# EAGLE design nrf51822 (EAGLE 7.2.0)
CNAME: BLEoT; CREVISION: 1.1; DESIGNER: Mohammed Aljarrah
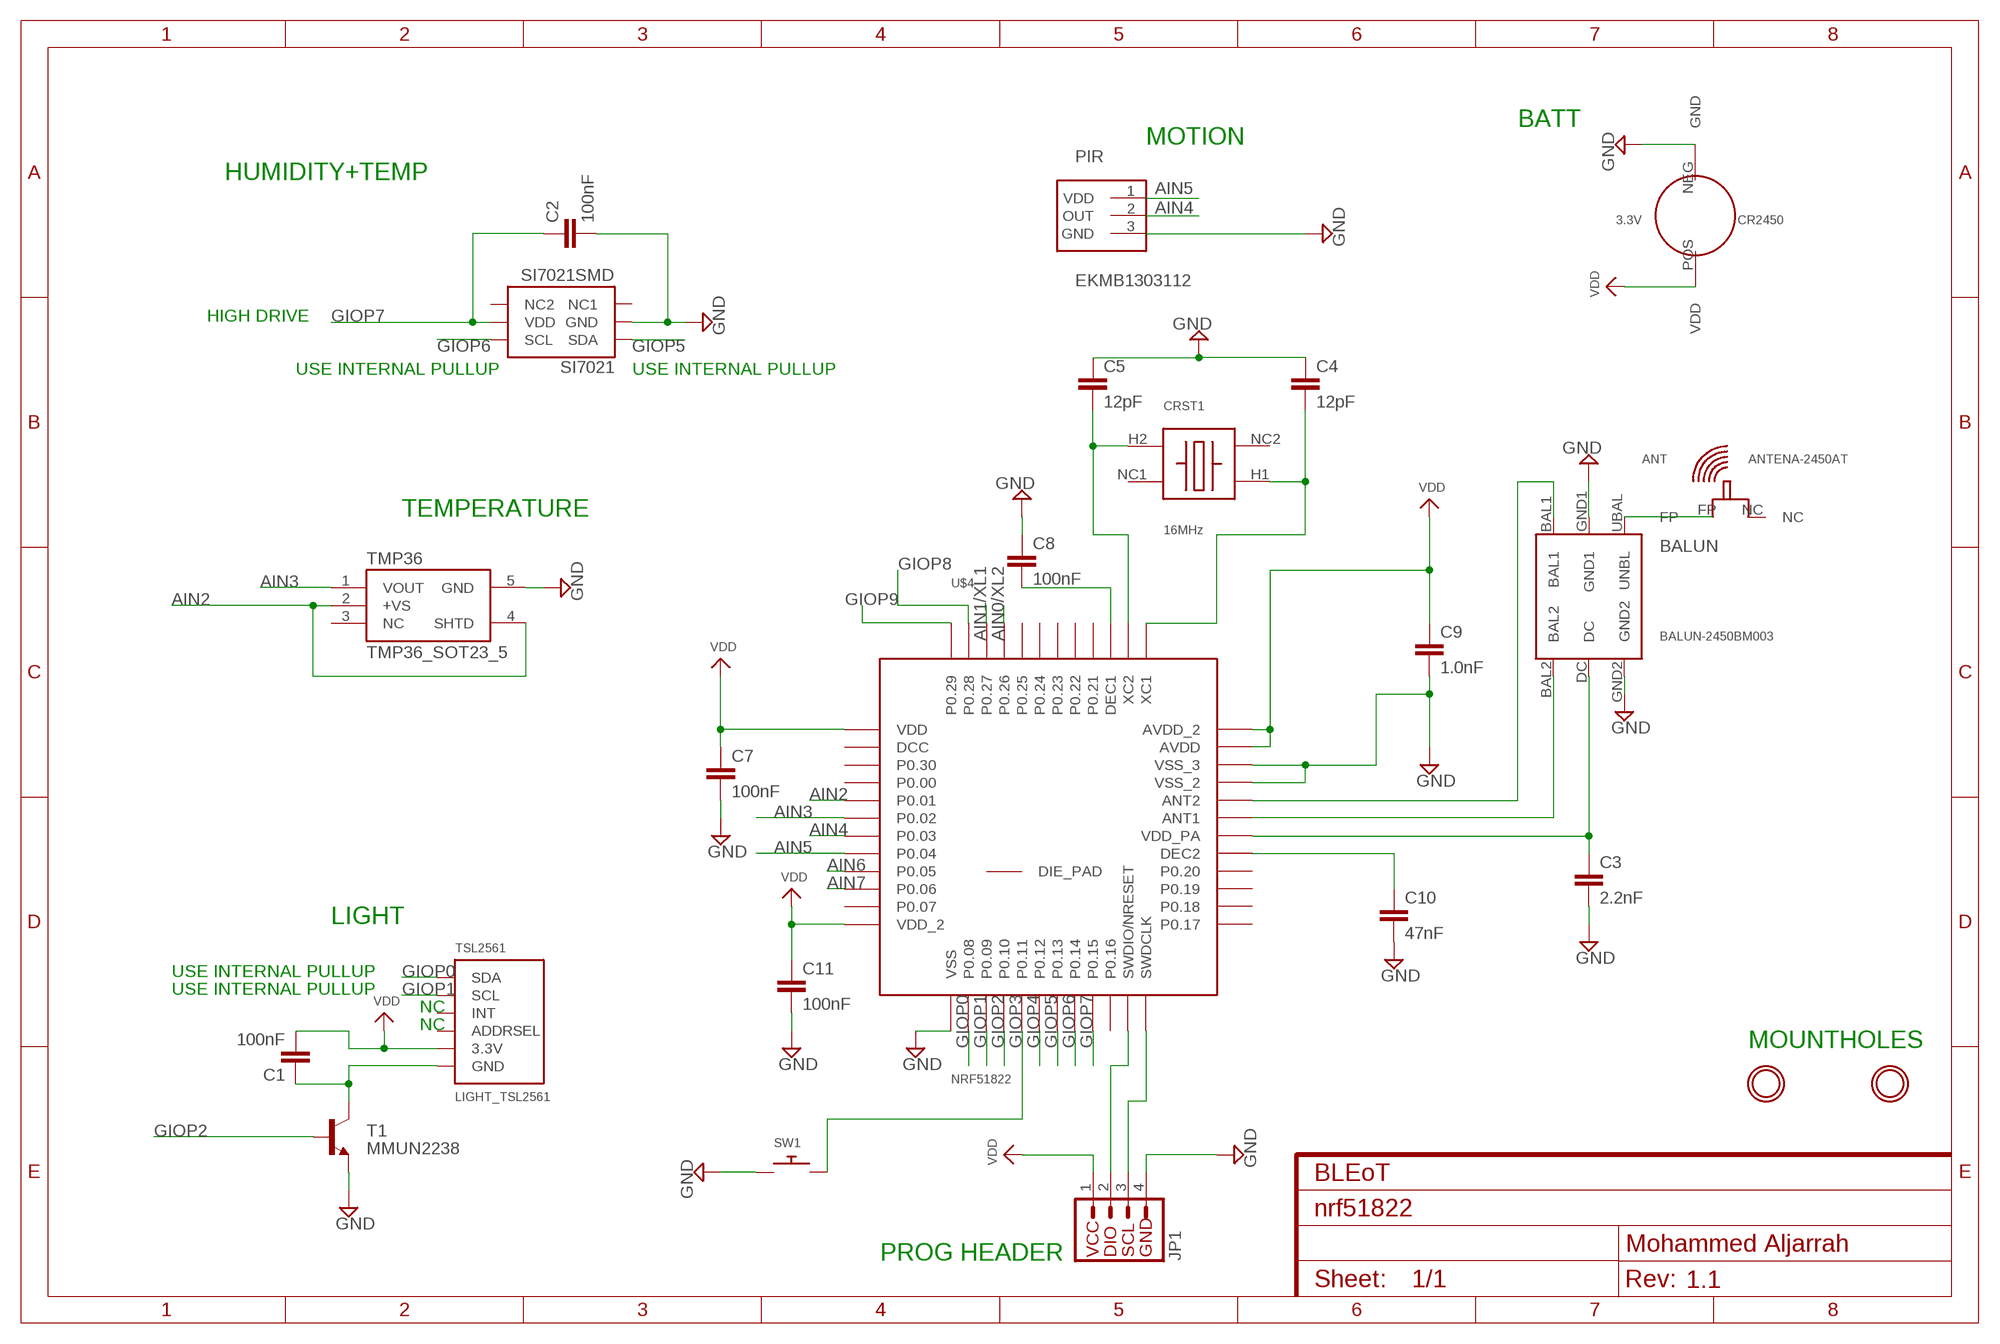
[diagram p0: schematic, sheet 1]

## Parts
ANT  ANTENA-2450AT  [2450AT18B100]
BALUN  BALUN-2450BM003  [2450BM14E0003]
C1  100nF  C-EUC0805  [C0805]
C2  100nF  C-EUC0805  [C0805]
C3  2.2nF  C-EUC0805  [C0805]
C4  12pF  C-EUC0805  [C0805]
C5  12pF  C-EUC0805  [C0805]
C7  100nF  C-EUC0805  [C0805]
C8  100nF  C-EUC0805  [C0805]
C9  1.0nF  C-EUC0805  [C0805]
C10  47nF  C-EUC0805  [C0805]
C11  100nF  C-EUC0805  [C0805]
CR2450  3.3V  CR2450  [CR2450]
CRST1  16MHz  CX3225GB  [CRYSTAL16MHZ]
JP1  PROG_HEADER  [1X04]
PIR  EKMB1303112  [TO5]
SI7021  SI7021SMD  [SI7021]
SW1  SWITCH_PUSHBUTTONSOFTTOUCHSMD_SJ  [PUSHBUTTON_SMD_SJ]
T1  MMUN2238  TRANSISTOR_NPNMMBT2222A  [SOT23-3]
TMP36  TMP36_SOT23_5  [SOT23-5]
TSL2561  LIGHT_TSL2561  [TSL2561_FN]
U$4  NRF51822  [QFN48]
U$6  MOUNTINGHOLE2.5  [MOUNTINGHOLE_2.5_PLATED]
U$7  MOUNTINGHOLE2.5  [MOUNTINGHOLE_2.5_PLATED]

## Nets
AIN0/XL2: U$4.45(P0.26)
AIN1/XL1: U$4.46(P0.27)
AIN2: TMP36.2(+VS) TMP36.4(SHTD) U$4.5(P0.01)
AIN3: TMP36.1(VOUT) U$4.6(P0.02)
AIN4: PIR.2(OUT) U$4.7(P0.03)
AIN5: PIR.1(VDD) U$4.8(P0.04)
AIN6: U$4.9(P0.05)
AIN7: U$4.10(P0.06)
GIOP0: TSL2561.DATA(SDA) U$4.14(P0.08)
GIOP1: TSL2561.CLK(SCL) U$4.15(P0.09)
GIOP2: T1.1(B) U$4.16(P0.10)
GIOP3: SW1.P$2 U$4.17(P0.11)
GIOP4: U$4.18(P0.12)
GIOP5: SI7021.1(SDA) U$4.19(P0.13)
GIOP6: SI7021.6(SCL) U$4.20(P0.14)
GIOP7: C2.1 SI7021.5(VDD) U$4.21(P0.15)
GIOP8: U$4.47(P0.28)
GIOP9: U$4.48(P0.29)
GND: BALUN.GND1 BALUN.GND2 C2.2 C3.2 C4.1 C5.1 C7.2 C8.1 C9.2 C10.2 C11.2 JP1.4 PIR.3(GND) SI7021.2(GND) SW1.P$1 T1.2(E) TMP36.5(GND) U$4.13(VSS) U$4.33(VSS_2) U$4.34(VSS_3)
N$1: C5.2 CRST1.H2 U$4.38(XC2)
N$2: C4.2 CRST1.H1 U$4.37(XC1)
N$3: ANT.FP BALUN.UBAL(UNBL)
N$4: BALUN.DC C3.1 U$4.30(VDD_PA)
N$5: C8.2 U$4.39(DEC1)
N$6: BALUN.BAL1 U$4.32(ANT2)
N$7: C1.1 T1.3(C) TSL2561.VSS(GND)
N$10: BALUN.BAL2 U$4.31(ANT1)
N$12: JP1.2 U$4.23(SWDIO/NRESET)
N$13: C10.1 U$4.29(DEC2)
N$14: JP1.3 U$4.24(SWDCLK)
VDD: C1.2 C7.1 C9.1 C11.1 JP1.1 TSL2561.VDD(3.3V) U$4.1(VDD) U$4.12(VDD_2) U$4.35(AVDD) U$4.36(AVDD_2)
Unconnected: ANT.NC CRST1.NC1 CRST1.NC2 SI7021.3(NC1) SI7021.4(NC2) TMP36.3(NC) TSL2561.ADR(ADDRSEL) TSL2561.INT U$4.2(DCC) U$4.3(P0.30) U$4.4(P0.00) U$4.11(P0.07) U$4.22(P0.16) U$4.25(P0.17) U$4.26(P0.18) U$4.27(P0.19) U$4.28(P0.20) U$4.40(P0.21) U$4.41(P0.22) U$4.42(P0.23) U$4.43(P0.24) U$4.44(P0.25) U$4.GND(DIE_PAD)

## Notes on the sheet
- BATT
- MOTION
- HUMIDITY+TEMP
- HIGH DRIVE
- USE INTERNAL PULLUP | USE INTERNAL PULLUP
- TEMPERATURE
- LIGHT
- USE INTERNAL PULLUP
- USE INTERNAL PULLUP
- NC
- NC
- MOUNTHOLES
- PROG HEADER

## Power pins joined to a net without a drawn wire
GND: CR2450.NEG(GND)
VDD: CR2450.POS(VDD)

## Library data of the parts
ANT = NordicSemi:ANTENA-2450AT: General Specifications: Part Number 2450AT18B100 Input Power 3W max. Frequency Range 2400 - 2500 Mhz Impedance 50 Ω Peak Gain 0.5 dBi typ. (XZ-V) Operating Temperature -40 to +85°C Average Gain -0.5 dBi typ. (XZ-V) Reel Quanity 3,000 Return Loss 9.5 dB min
BALUN = NordicSemi:BALUN-2450BM003: 2450BM14E0003 2.45GHz Impedance Matched Balun + Band Pass Filter: Optimized for Nordic's Chipset nRF51822 and nRF51422
C1-C5 C7-C11 = rcl:C-EU: CAPACITOR, European symbol
CR2450 = NordicSemi:CR2450: CR2450 Mouser Part No: 614-SMTU2450N-LF.TR Manufacturer Part No: SMTU2450N-LF.TR
CRST1 = NordicSemi:CX3225GB: Mouser: 581-CX3225GB16DHPQCC Manufacturer: CX3225GB16000D0HPQCC 16MHz 8pF +/-20ppm Features • Crystal unit for Consumer Products • Small and low profile 0.9mm max. (3.2×2.5×0.8mm) • Ceramic package • Reflow compatible
JP1 = NordicSemi:PROG_HEADER: SparkFun has standardized on a pinout for all I2C based sensor breakouts. This pinout allows I2C boards to be plugged directly into the headers on Arduino Uno compatible boards, and to be daisy chained easily.
PIR = NordicSemi:EKMB1303112: PIR (Motion detector) Mouser Part No: 769-EKMB1303112 Manufacturer Part No: EKMB1303112
SI7021 = NordicSemi:SI7021: Humidity and temp sensor Mouser Part No: 634-SI7021-A-GM Manufacturer Part No: Si7021-A10-GM
SW1 = microbuilder:SWITCH_PUSHBUTTON: Buttons SOFTTOUCHSMD_SJ - Soft touch temporary push button (Super Junk Akihabara) Compatible with SKPMANE010 [Mouser: 688-SKPMAN]
T1 = SparkFun-DiscreteSemi:TRANSISTOR_NPN: Generic NPN BJT MMBT2222A - TRANS-08049 (SOT-23, 1A 40V) MPSA42 - TRANS-09116 (SOT-23, 500mA 300V) MMBT5088LT1G - TRANS-11160 (SOT-23, 50 mA 30V) BC547 - COM-08928 <http://www.sparkfun.com/products/8928> (TO-92 45V 100mA) (1.Collector 2.Base 3.Emitter) 2N3904 - COM-00521 <http://www.sparkfun.com/products/521> (TO-92 40V 200mA) (1.Emitter 2.Base 3.Collector) P2N2222A - COM-12852 <http://www.sparkfun.com/products/12852> (TO-92 40V 600mA) (1.Collector 2.Base 3.Emitter); PROD_ID: TRANS-08049; VALUE: MMBT2222A
TMP36 = NordicSemi:TMP36_SOT23_5: TMP36 analog temp sensor Mouser Part No: 584-TMP36GRTZ-R7 Manufacturer Part No: TMP36GRTZ-REEL7
TSL2561 = microbuilder:LIGHT_TSL2561: TSL2561 Light-To-Digital Sensor Mouser Part Numbers: CS (obsolete): 856-TSL2561CS DFN (cheapest): 856-TSL2561FN
U$4 = NordicSemi:NRF51822: Bluetooth 4.0 Low Energy/2.4Ghz NORDIC SEMICONDUCTOR
U$6 U$7 = microbuilder:MOUNTINGHOLE: Mounting Hole For #2 screws (0.086"/2.18mm width, 0.094"/2.4mm hole) use 2.5mm

## Net classes
0 default: width 0.152 mm, drill 0.508 mm, clearance 0.152 mm

## Board
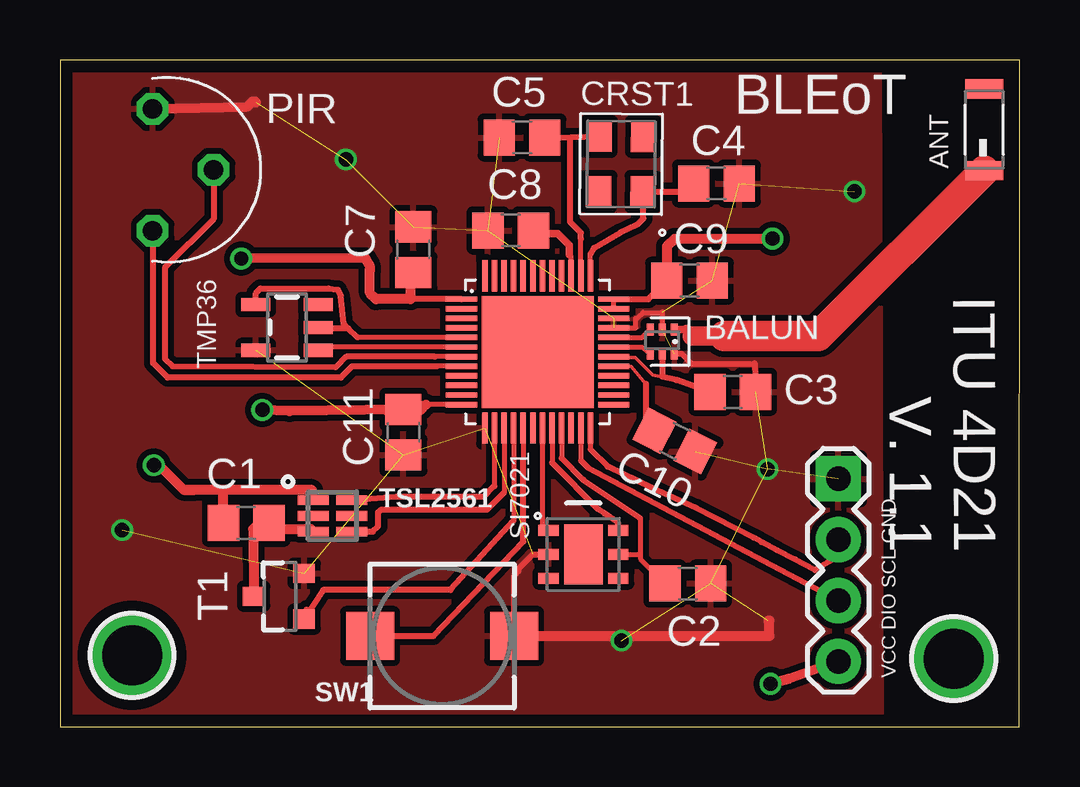
[diagram p1: board, top side]
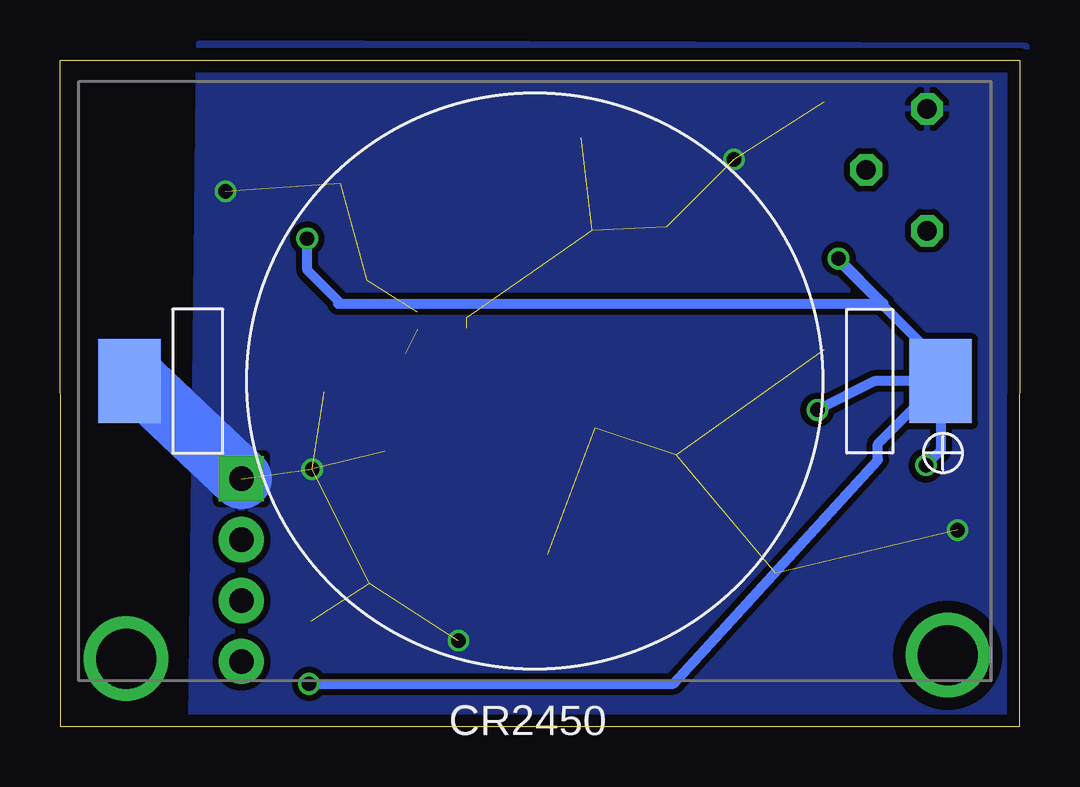
[diagram p2: board, bottom side, seen from below]

Size 39.99 x 27.8 mm. Coordinates in mm from the lower left corner, seen from the top.
Outline: 0.02,0 39.96,0 39.99,27.8 0,27.79 0.02,0
Copper layers (1*16): Top 0.035mm / dielectric 1.5mm / Bottom 0.035mm
Design rules "EagleRules *": minimum track width 6mil, minimum drill 12mil, track to track 6mil, track to pad 6mil, pad to pad 6mil, via to via 6mil, smd to smd 0mil, copper to edge 20mil, drill to drill 10mil, minimum pad ring 10mil, minimum via ring 6mil, stop-mask expansion 2mil, vias tented up to drill 25mil, thermal gap 10mil

### Footprints (pad centres in the part's own frame; a part is rotated, then mirrored left to right if it is on the bottom)
2450AT18B100 = smd 0.8 x 1.6: FP -1.7,0; NC 1.7,0
2450BM14E0003 = smd 0.3 x 0.5: BAL1 0,0; BAL2 0,-1; DC 0.5,-1; GND1 0.5,0; GND2 1,-1; UBAL 1,0
C0805 = smd 1.3 x 1.5: 1 -0.95,0; 2 0.95,0
CR2450 = smd 2.6 x 3.5: NEG 16.9,0; POS -16.9,0
CRYSTAL16MHZ = smd 1.3 x 1.05: H1 -1.15,-0.925; H2 1.15,0.925; NC1 -1.15,0.925; NC2 1.15,-0.925
1X04 = drill 1.016 pad 1.88: 1 0,0; 2 2.54,0; 3 5.08,0 | drill 1.016 pad 1.88 square: 4 7.62,0
TO5 = drill 0.813 octagon: 1 0,-2.54; 2 2.54,0; 3 0,2.54
SI7021 = smd 0.85 x 0.45: 1 1.45,-1; 2 1.45,0; 3 1.45,1; 4 -1.45,1; 5 -1.45,0; 6 -1.45,-1 | smd 1.6 x 2.5: 7 0,0
PUSHBUTTON_SMD_SJ = smd 2 x 2: P$1 3,0; P$2 -3,0
SOT23-3 = smd 0.8 x 0.9: 1 -0.95,-1; 2 0.95,-1; 3 0,1.1
SOT23-5 = smd 0.55 x 1.2: 1 -0.95,-1.3; 2 0,-1.3; 3 0.95,-1.3; 4 0.95,1.3; 5 -0.95,1.3
TSL2561_FN = smd 1.3 x 0.4: ADR -0.8,0; CLK 0.8,-0.65; DATA 0.8,0.65; INT 0.8,0; VDD -0.8,0.65; VSS -0.8,-0.65
QFN48 = smd 1.3 x 0.226: 1 -3.17,2.2; 2 -3.17,1.8; 3 -3.17,1.4; 4 -3.17,1; 5 -3.17,0.6; 6 -3.17,0.2; 7 -3.17,-0.2; 8 -3.17,-0.6; 9 -3.17,-1; 10 -3.17,-1.4; 11 -3.17,-1.8; 12 -3.17,-2.2; 25 3.17,-2.2; 26 3.17,-1.8; 27 3.17,-1.4; 28 3.17,-1; 29 3.17,-0.6; 30 3.17,-0.2; 31 3.17,0.2; 32 3.17,0.6; 33 3.17,1; 34 3.17,1.4; 35 3.17,1.8; 36 3.17,2.2 | smd 0.226 x 1.3: 13 -2.2,-3.17; 14 -1.8,-3.17; 15 -1.4,-3.17; 16 -1,-3.17; 17 -0.6,-3.17; 18 -0.2,-3.17; 19 0.2,-3.17; 20 0.6,-3.17; 21 1,-3.17; 22 1.4,-3.17; 23 1.8,-3.17; 24 2.2,-3.17; 37 2.2,3.17; 38 1.8,3.17; 39 1.4,3.17; 40 1,3.17; 41 0.6,3.17; 42 0.2,3.17; 43 -0.2,3.17; 44 -0.6,3.17; 45 -1,3.17; 46 -1.4,3.17; 47 -1.8,3.17; 48 -2.2,3.17 | smd 4.66 x 4.66: GND 0,0
MOUNTINGHOLE_2.5_PLATED = drill 2.5 pad 3.2: P$1 0,0

### Placement (x,y rotation side)
ANT  38.51,24.89 90 top
BALUN  24.59,16.56 0 top
C1  7.76,8.5 180 top
C2  26.16,5.97 0 top
C3  28.03,13.96 0 top
C4  27.35,22.65 180 top
C5  19.25,24.57 0 top
C7  14.72,19.89 90 top
C8  18.78,20.69 0 top
C9  26.23,18.6 0 top
C10  25.62,11.91 333 top
C11  14.31,12.28 270 top
CR2450  20.2,14.41 180 bottom
CRST1  23.38,23.46 89.5 top
JP1  32.43,2.72 90 top
PIR  3.86,23.22 0 top
SI7021  21.81,7.19 180 top
SW1  15.92,3.78 0 top
T1  9.17,5.44 90 top
TMP36  9.46,16.65 90 top
TSL2561  11.35,8.79 0 top
U$4  19.9,15.63 0 top
U$6  3,2.98 0 top
U$7  37.24,2.84 0 top

### Tracks (layer width: path | path; a pad name or v marks a point on that pad's centre or on a via)
AIN2
  Top 0.178: U$4.5
  Top 0.203: U$4.5 12.41,16.23 | 10.8,16.61 TMP36.2 | 11.82,16.81 12.02,16.61
  Top 0.254: 10.8,16.61 12.02,16.61 12.4,16.23 12.41,16.23 | 11.82,16.81 11.7,17.96 11.58,18.22 11.18,18.27 8.35,18.27 8.16,18.08 TMP36.4
AIN3
  Top 0.203: U$4.6 10.89,15.83 TMP36.1
AIN4
  Top 0.203: U$4.7 15.62,15.43 15.6,15.41
  Top 0.254: 15.62,15.43 11.93,15.43 11.5,15 11.48,14.99 4.68,15.03 4.37,15.34 4.37,19.14 6.4,21.17 PIR.2
AIN5
  Top 0.203: U$4.8 15.72,15.03 15.71,15.02
  Top 0.254: 15.71,15.02 12.16,15.02 11.7,14.56 4.48,14.56 3.88,15.16 3.88,20.66 PIR.1
GIOP0
  Top 0.178: 18.13,12.43 U$4.14
  Top 0.203: U$4.14 18.1,10.03
  Top 0.254: 18.1,10.03 17.66,9.59 14.01,9.59 TSL2561.DATA
GIOP1
  Top 0.203: U$4.15 18.5,9.76
  Top 0.254: TSL2561.CLK 13.04,8.14 13.26,8.36 13.26,8.94 13.38,9.06 17.8,9.06 18.5,9.76
GIOP2
  Top 0.203: U$4.16 18.91,8.63 18.91,8.61 18.89,8.59
  Top 0.254: 10.28,4.89 T1.1 10.96,5.7 16.27,5.7 18.89,8.59
GIOP3
  Top 0.203: U$4.17 19.3,11.13
  Top 0.254: SW1.P$2 15.56,3.78 19.31,7.72 19.3,11.13
GIOP5
  Top 0.203: U$4.19 20.1,8.4
  Top 0.254: 20.1,8.4 SI7021.1
GIOP6
  Top 0.203: U$4.20 20.5,11
  Top 0.254: SI7021.6 23.26,8.5 22.69,8.89 22.43,9.07 20.5,11
GIOP7
  Top 0.203: U$4.21 20.9,11.2 | 24.17,8.7 24.18,7.16 | 24.18,7.16 24.18,7 C2.1 | SI7021.5 24.15,7.19 24.18,7.16
  Top 0.254: 20.9,11.2 21.81,10.29 24.17,8.7
GND  (via drill 0.6)  (21 unrouted)
  Top 0.203: U$4.33 23.98,16.63 23.99,16.64 23.99,17.01 23.97,17.03 24.06,17.03 24.3,17.27 25.07,17.27 25.1,17.3 BALUN.GND1
  Top 0.254: SW1.P$1 18.92,6.31 19.1,6.49 19.1,6.59 19.69,7.18 20.3,7.18 SI7021.2 | BALUN.GND2 25.9,15.56 26.33,15.13 28.94,15.15 C3.2
  Top 0.406: PIR.3 7.81,25.86 8.02,26.07 8.12,26.07 8.16,26.03 | SW1.P$1 29.56,3.78 29.56,4.42 29.52,4.42 29.52,4.38
  Bottom 0.305: 35.13,13.1 CR2450.NEG
  Bottom 1.27: 35.13,13.1 36.98,14.65
  Bottom 2.54: 36.98,14.65 JP1.4
  other vias: 11.91,23.65 2.59,8.2 23.39,3.59 33.1,22.32 29.48,10.74
  pour Top (isolate 0.254): 34.11,28.29 34.19,0.07 -0.01,0.17 -0.19,28.29
  pour Bottom (isolate 0.254): -0.29,28.39 34.21,28.49 34.54,0.19 0.04,0.09
N$1
  Top 0.203: U$4.38 21.7,20.34
  Top 0.254: 21.7,20.34 21.7,20.6 21.25,21.04 21.25,24.54 21.29,24.58 | C5.2 21.29,24.58 | 21.29,24.58 CRST1.H2
N$2
  Top 0.203: U$4.37 22.1,19.71
  Top 0.254: CRST1.H1 24.31,22.29 24.31,21.19 24.06,20.94 23.34,20.6 22.24,19.96 22.1,19.71 | 24.32,22.28 CRST1.H1 | CRST1.H1 26.38,22.3 C4.2
N$3
  Top 0.305: BALUN.UBAL 26.08,16.56
  Top 0.406: 26.08,16.56 26.28,16.36 26.28,16.34 26.34,16.28
  Top 0.813: 26.34,16.28 27.68,16.28 27.69,16.27
  Top 1.27: 27.68,16.28 31.6,16.28 ANT.FP
N$4
  Top 0.152: U$4.30 arc90 23.11,15.39 23.96,15.4 24.69,14.67 25.11,14.59
  Top 0.254: BALUN.DC 25.09,14.61 25.11,14.59 25.69,14.45 C3.1
N$5
  Top 0.203: U$4.39 21.3,19.61 21.22,19.69
  Top 0.305: 21.22,19.69 21.22,20.09 20.74,20.57 19.78,20.57 C8.2
N$6
  Top 0.203: U$4.32 24.26,16.23 BALUN.BAL1
N$7
  Top 0.203: 8.28,8.47 8.68,8.47 C1.1
  Top 0.254: 10.55,8.26 TSL2561.VSS 10.46,8.23
  Top 0.406: 8.86,8.23 8.28,8.47 8.05,8.24 T1.3 | 10.46,8.23 8.48,8.23 C1.1
N$10
  Top 0.203: U$4.31 24.24,15.83 BALUN.BAL2
N$12
  Top 0.203: U$4.23 21.7,11.1
  Top 0.254: 21.7,11.1 22.01,10.79 JP1.2 32.38,5.31
N$13
  Top 0.152: U$4.29 23.8,15.02 24.41,14.29
  Top 0.254: 24.41,14.29 24.41,12.71 C10.1
N$14
  Top 0.203: U$4.24 22.1,11.57
  Top 0.254: 22.1,11.57 22.82,10.85 24.68,9.95 26.5,9.13 28.9,7.89 29.23,7.7 29.88,7.36 30.62,6.98 31.45,6.53 32.42,7.11 JP1.3
VDD  (via drill 0.6)
  Top 0.178: U$4.36 24.51,17.83 C9.1
  Top 0.203: U$4.35 U$4.36 | U$4.12 15.24,13.43 | 13.63,13.17 C11.1
  Top 0.254: U$4.1 14.6,17.83 | U$4.36 24.52,17.83 25.39,18.7 | C9.1
  Top 0.406: 12.91,19.03 12.91,18.09 13.17,17.83 14.6,17.83 14.6,18.94 C7.1 | 12.91,19.03 12.91,19.1 | v3.91,10.9 4.13,10.9 5.15,9.88 | 5.15,9.88 5.56,9.87 5.51,9.87 | 15.24,13.43 14.98,13.17 13.63,13.17 | 25.39,18.7 25.34,18.7 | v29.69,20.35 25.61,20.35 25.29,20.03 C9.1 | v7.55,19.52 7.45,19.53 12.72,19.52 12.9,19.23 12.91,19.03 | C11.1 9.56,13.16 v8.43,13.21 | JP1.1 30.38,2 v29.61,1.79 | TSL2561.VDD 10.51,9.87 6.74,9.87 | 6.74,9.87 5.57,9.87 5.15,9.88 | C1.2 6.81,9.8 6.74,9.87
  Bottom 0.406: 3.14,15.37 2.91,14.8 | 2.91,14.8 CR2450.POS | CR2450.POS 3.3,11.51 v3.91,10.9 | v29.69,20.35 v29.68,20.34 29.68,19.03 28.4,17.75 28.4,17.64 5.68,17.64 5.68,17.65 v7.55,19.52 7.5,19.28 7.39,19.28 2.91,14.8 | v29.61,1.79 14.43,1.79 5.91,11.13 5.91,11.8 CR2450.POS | CR2450.POS 6.05,14.41 v8.43,13.21
  Bottom 0.61: CR2450.POS 2.62,15.04

### Text on the board
tPlace: BLEoT | ITU 4D21 / V. 1.1 | VCC DIO SCL GND